# Altium schematic sheet RTD_interface.SchDoc: PT1000 RTD Interface
size A3
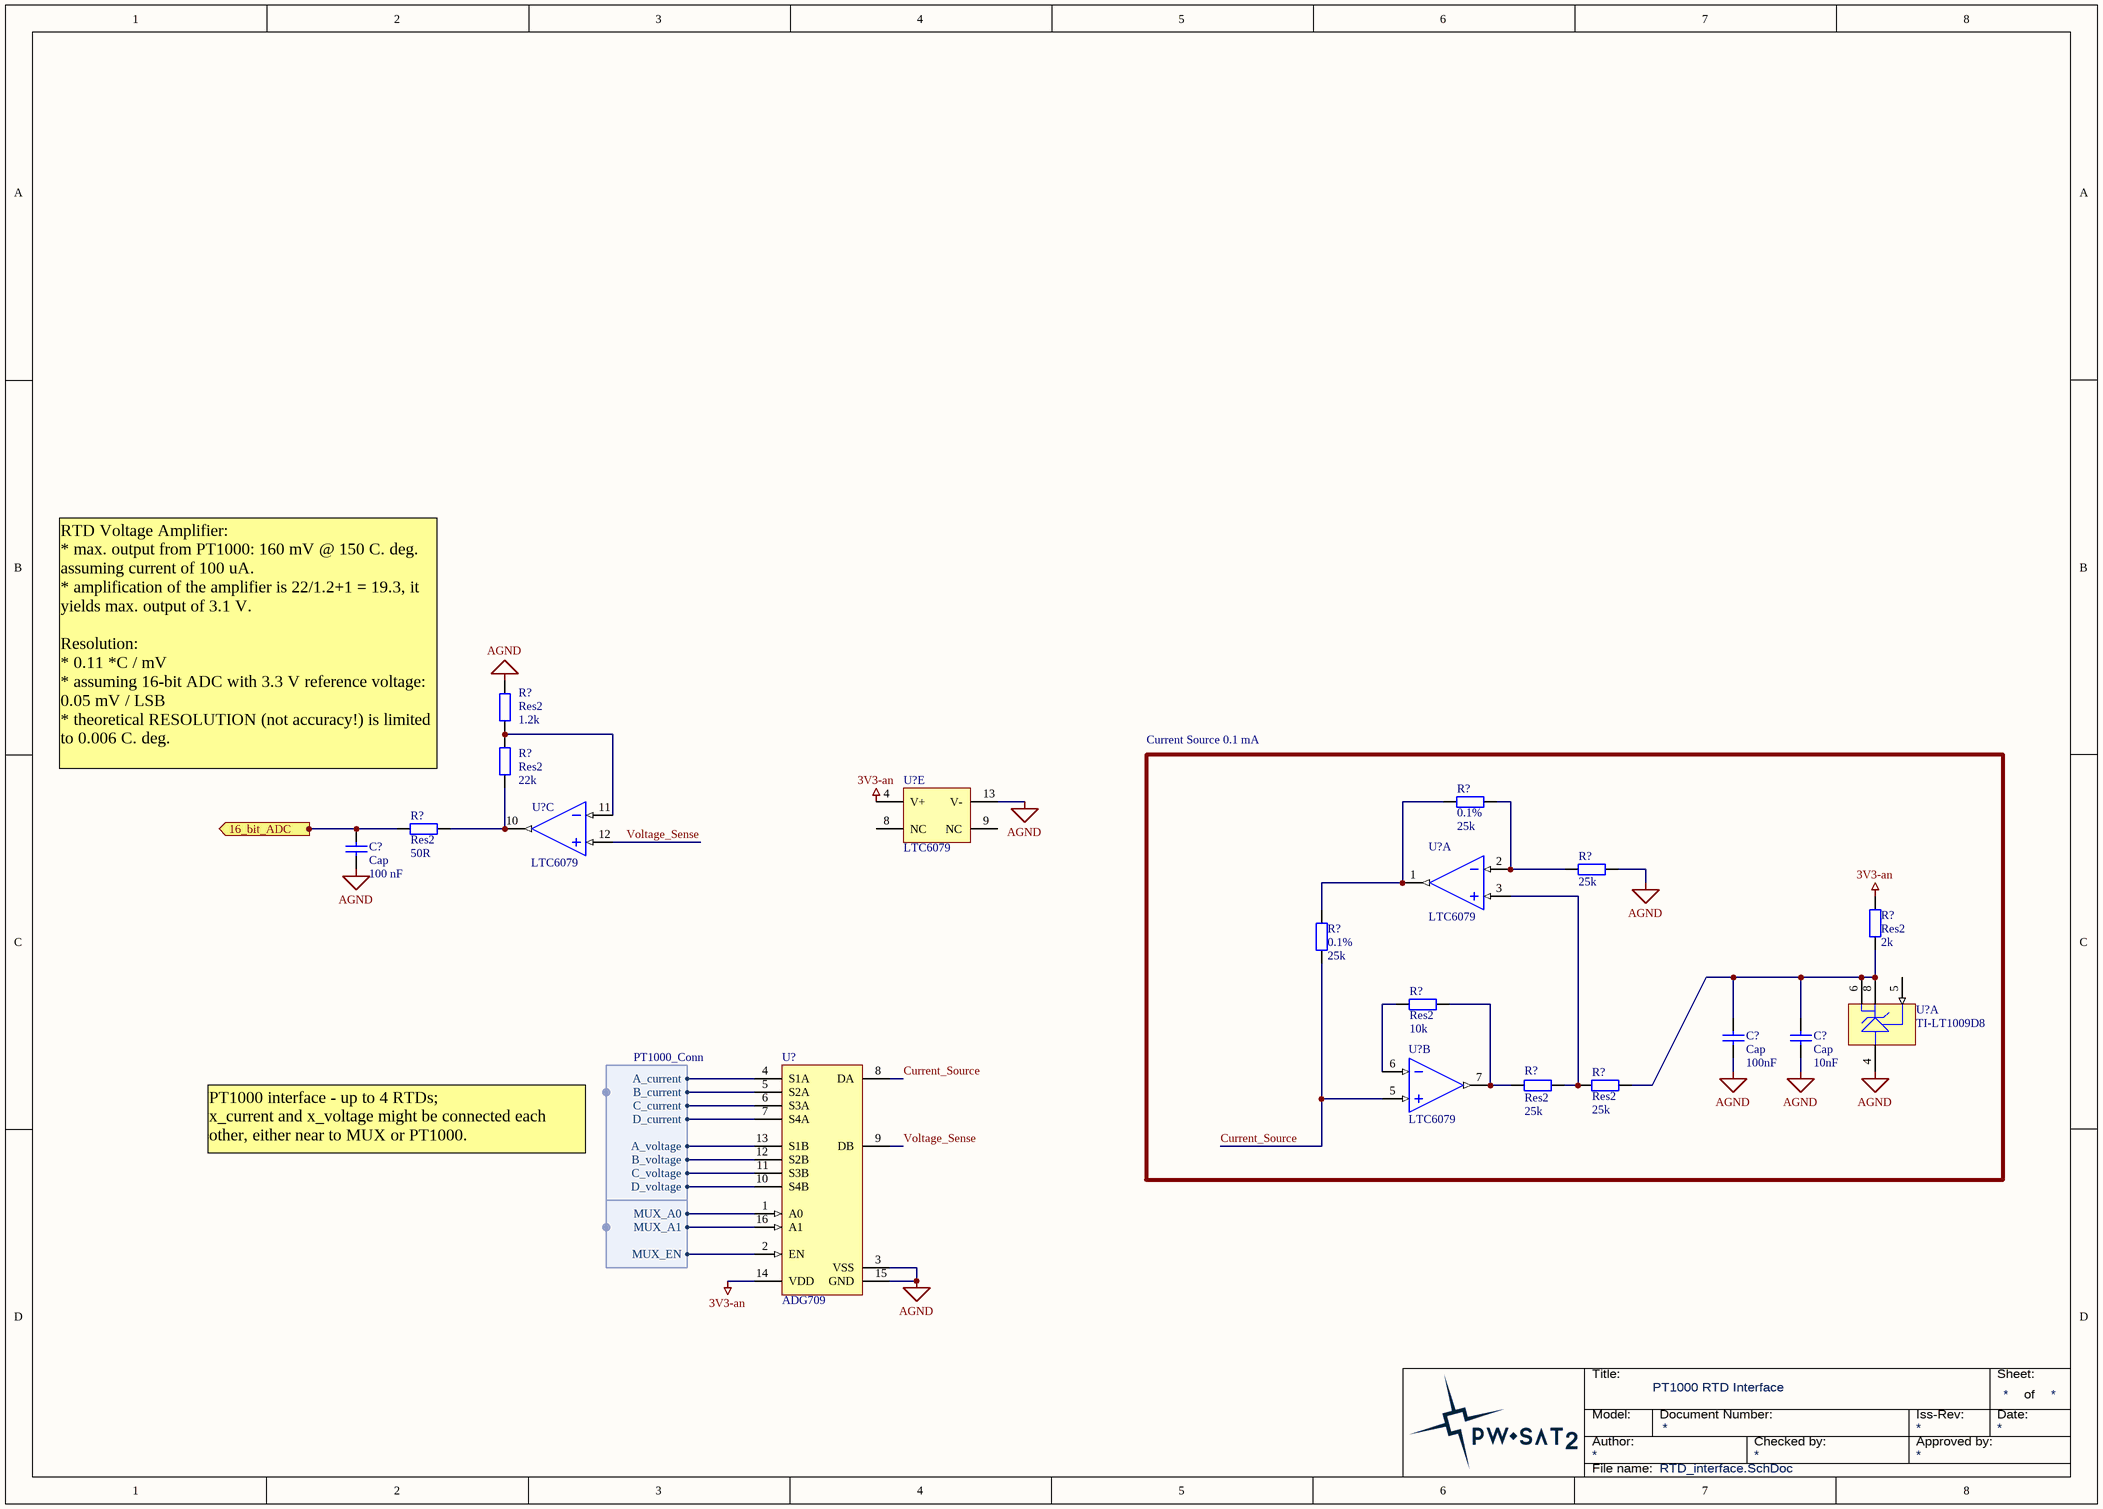
[diagram p0: RTD_interface.SchDoc]

## Parts
(Parts that share a designator on the sheet are numbered #1, #2 ... from top to bottom, then left to right.)
C?#1  Cap  value 100 nF  [RAD-0.3]
C?#2  Cap  value 100nF  [RAD-0.3]
C?#3  Cap  value 10nF  [RAD-0.3]
R?#1  Res2  value 1.2k  [AXIAL-0.4]
R?#2  Res2  value 22k  [AXIAL-0.4]
R?#3  0.1%  value 25k  [AXIAL-0.4]
R?#4  Res2  value 50R  [AXIAL-0.4]
R?#5  value 25k  [AXIAL-0.4]  (hidden comment: Res2)
R?#6  Res2  value 2k  [AXIAL-0.4]
R?#7  0.1%  value 25k  [AXIAL-0.4]
R?#8  Res2  value 10k  [AXIAL-0.4]
R?#9  Res2  value 25k  [AXIAL-0.4]
R?#10  Res2  value 25k  [AXIAL-0.4]
U?#1  LTC6079  [SSOP-16]  (part E of 5)
U?#2  LTC6079  [SSOP-16]  (part C of 5)
U?#3  LTC6079  [SSOP-16]  (part A of 5)
U?#4  TI-LT1009D8  [TI-D8_N]  (part A of 2)
U?#5  LTC6079  [SSOP-16]  (part B of 5)
U?#6  ADG709  [TSSOP16]

## Blocks framed on the sheet
Current Source 0.1 mA: C?#2 C?#3 R?#3 R?#5-R?#10 U?#3-U?#5

## Ports
16_bit_ADC (out)

## Harnesses
PT1000_Control: MUX_A0, MUX_A1, MUX_EN
PT1000_Conn: A_current, B_current, C_current, D_current, A_voltage, B_voltage, C_voltage, D_voltage

## Nets
3V3-an: R?#6.2 U?#1.4(V+) U?#6.14(VDD)
AGND: C?#1.1 C?#2.1 C?#3.1 R?#1.1 R?#5.2 U?#1.13(V-) U?#4.4(ANODE) U?#6.3(VSS) U?#6.15(GND)
16_bit_ADC: C?#1.2 R?#4.1 ; port 16_bit_ADC
Current_Source: R?#7.1 U?#5.5(IN+_B) U?#6.8(DA)
Voltage_Sense: U?#2.12(IN+_C) U?#6.9(DB)
NetC?#2_2: C?#2.2 C?#3.2 R?#6.1 R?#10.2 U?#4.6(CATHODE) U?#4.8(CATHODE)
NetR?#1_2: R?#1.2 R?#2.1 U?#2.11(IN-_C)
NetR?#2_2: R?#2.2 R?#4.2 U?#2.10(OUT_C)
NetR?#3_1: R?#3.1 R?#7.2 U?#3.1(OUT_A)
NetR?#3_2: R?#3.2 R?#5.1 U?#3.2(IN-_A)
NetR?#8_1: R?#8.1 U?#5.6(IN-_B)
NetR?#8_2: R?#8.2 R?#9.1 U?#5.7(OUT_B)
NetR?#9_2: R?#9.2 R?#10.1 U?#3.3(IN+_A)
NetU?#6_1: U?#6.1(A0) ; harness PT1000_Control.MUX_A0
NetU?#6_2: U?#6.2(EN) ; harness PT1000_Control.MUX_EN
NetU?#6_4: U?#6.4(S1A) ; harness PT1000_Conn.A_current
NetU?#6_5: U?#6.5(S2A) ; harness PT1000_Conn.B_current
NetU?#6_6: U?#6.6(S3A) ; harness PT1000_Conn.C_current
NetU?#6_7: U?#6.7(S4A) ; harness PT1000_Conn.D_current
NetU?#6_10: U?#6.10(S4B) ; harness PT1000_Conn.D_voltage
NetU?#6_11: U?#6.11(S3B) ; harness PT1000_Conn.C_voltage
NetU?#6_12: U?#6.12(S2B) ; harness PT1000_Conn.B_voltage
NetU?#6_13: U?#6.13(S1B) ; harness PT1000_Conn.A_voltage
NetU?#6_16: U?#6.16(A1) ; harness PT1000_Control.MUX_A1

Not connected (* = marked no-connect by the designer): U?#1 8(NC) 9(NC); U?#4 5(ADJ)

## Notes on the sheet
- RTD Voltage Amplifier:
  * max. output from PT1000: 160 mV @ 150 C. deg. assuming current of 100 uA.
  * amplification of the amplifier is 22/1.2+1 = 19.3, it yields max. output of 3.1 V.
  Resolution:
  * 0.11 *C / mV
  * assuming 16-bit ADC with 3.3 V reference voltage: 0.05 mV / LSB
  * theoretical RESOLUTION (not accuracy!) is limited to 0.006 C. deg.
- PT1000 interface - up to 4 RTDs;
  x_current and x_voltage might be connected each other, either near to MUX or PT1000.
- Title:
- Sheet:
- of
- Author:
- Model:
- Document Number:
- Checked by:
- Iss-Rev:
- Approved by:
- Date:
- File name:

## Library data of the parts
C?#1-C?#3 = Cap: Capacitor; Published: 8-Jun-2000; LatestRevisionDate: 17-Jul-2002; LatestRevisionNote: Re-released for DXP Platform.; PackageReference: RAD-0.3; Publisher: Altium Limited; PackageDescription: Radial Cap, Thru-Hole; 2 Leads; 0.3 in Pin Spacing
R?#1-R?#10 = Res2: Resistor; Published: 8-Jun-2000; LatestRevisionDate: 17-Jul-2002; LatestRevisionNote: Re-released for DXP Platform.; PackageReference: AXIAL-0.4; Publisher: Altium Limited; PackageDescription: Axial Device, Thru-Hole; 2 Leads; 0.4 in Pin Spacing
U?#1-U?#3 U?#5 = LTC6079: Rail-to-rail, quad operational amplifier. Library compatible with LTC608X LTC607X op-amps